# EAGLE design esp32_makey_shield (EAGLE 9.6.2)
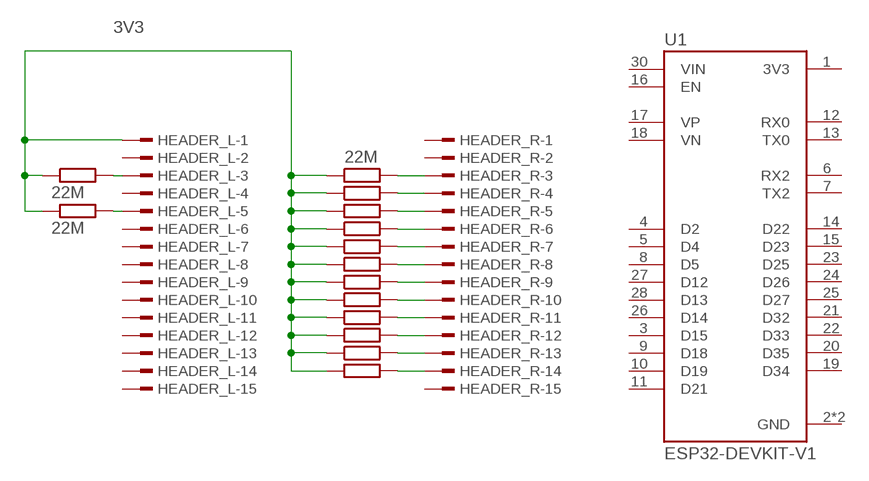
[diagram p0: schematic, sheet 1]

## Parts
HEADER_L  TSW-115-07-G-S  [TSW-115-XX-G-S]
HEADER_R  TSW-115-07-G-S  [TSW-115-XX-G-S]
R1  22M  R-EU_0204/7  [0204/7]
R2  22M  R-EU_0204/7  [0204/7]
R3  22M  R-EU_0204/7  [0204/7]
R4  22M  R-EU_0204/7  [0204/7]
R5  22M  R-EU_0204/7  [0204/7]
R6  22M  R-EU_0204/7  [0204/7]
R7  22M  R-EU_0204/7  [0204/7]
R8  22M  R-EU_0204/7  [0204/7]
R9  22M  R-EU_0204/7  [0204/7]
R10  22M  R-EU_0204/7  [0204/7]
R11  22M  R-EU_0204/7  [0204/7]
R12  22M  R-EU_0204/7  [0204/7]
R13  22M  R-EU_0204/7  [0204/7]
R14  22M  R-EU_0204/7  [0204/7]
U1  ESP32-DEVKIT-V1  [MODULE_ESP32_DEVKIT_V1]

## Nets
3V3: HEADER_L.1 R1.1 R2.1 R3.1 R4.1 R5.1 R6.1 R7.1 R8.1 R9.1 R10.1 R11.1 R12.1 R13.1 R14.1
N$1: HEADER_L.3 R13.2
N$2: HEADER_L.5 R14.2
N$3: HEADER_R.3 R1.2
N$4: HEADER_R.4 R2.2
N$5: HEADER_R.5 R3.2
N$6: HEADER_R.6 R4.2
N$7: HEADER_R.7 R5.2
N$8: HEADER_R.8 R6.2
N$9: HEADER_R.9 R7.2
N$10: HEADER_R.10 R8.2
N$11: HEADER_R.11 R9.2
N$12: HEADER_R.12 R10.2
N$13: HEADER_R.13 R11.2
N$14: HEADER_R.14 R12.2
Unconnected: HEADER_L.2 HEADER_L.4 HEADER_L.6 HEADER_L.7 HEADER_L.8 HEADER_L.9 HEADER_L.10 HEADER_L.11 HEADER_L.12 HEADER_L.13 HEADER_L.14 HEADER_L.15 HEADER_R.1 HEADER_R.2 HEADER_R.15 U1.1(3V3) U1.3(D15) U1.4(D2) U1.5(D4) U1.6(RX2) U1.7(TX2) U1.8(D5) U1.9(D18) U1.10(D19) U1.11(D21) U1.12(RX0) U1.13(TX0) U1.14(D22) U1.15(D23) U1.16(EN) U1.17(VP) U1.18(VN) U1.19(D34) U1.20(D35) U1.21(D32) U1.22(D33) U1.23(D25) U1.24(D26) U1.25(D27) U1.26(D14) U1.27(D12) U1.28(D13) U1.30(VIN)

## Power pins joined to a net without a drawn wire
GND: U1.2(GND) U1.29(GND)

## Library data of the parts
HEADER_L HEADER_R = con-samtec:TSW-115-*-G-S: THROUGH-HOLE .025" SQ POST HEADER Source: Samtec TSW.pdf; MF: Samtec Inc.; MPN: TSW-115-07-G-S
R1-R14 = rcl:R-EU_: RESISTOR, European symbol; SPICEPREFIX: R
U1 = ESP32-DEVKIT-V1:ESP32-DEVKIT-V1: Dual core, Wi-Fi: 2.4 GHz up to 150 Mbits/s,BLE (Bluetooth Low Energy) and legacy Bluetooth, 32 bits, Up to 240 MHz Check availability <https://pricing.snapeda.com/parts/ESP32-DEVKIT-V1/Do%20it/view-part?ref=eda>; AVAILABILITY: Not in stock; DESCRIPTION: Dual core, Wi-Fi: 2.4 GHz up to 150 Mbits/s,BLE (Bluetooth Low Energy) and legacy Bluetooth, 32 bits, Up to 240 MHz; MF: Do it; MP: ESP32-DEVKIT-V1; PACKAGE: None; PRICE: None

## Net classes
0 default: clearance 0.205 mm

## Board
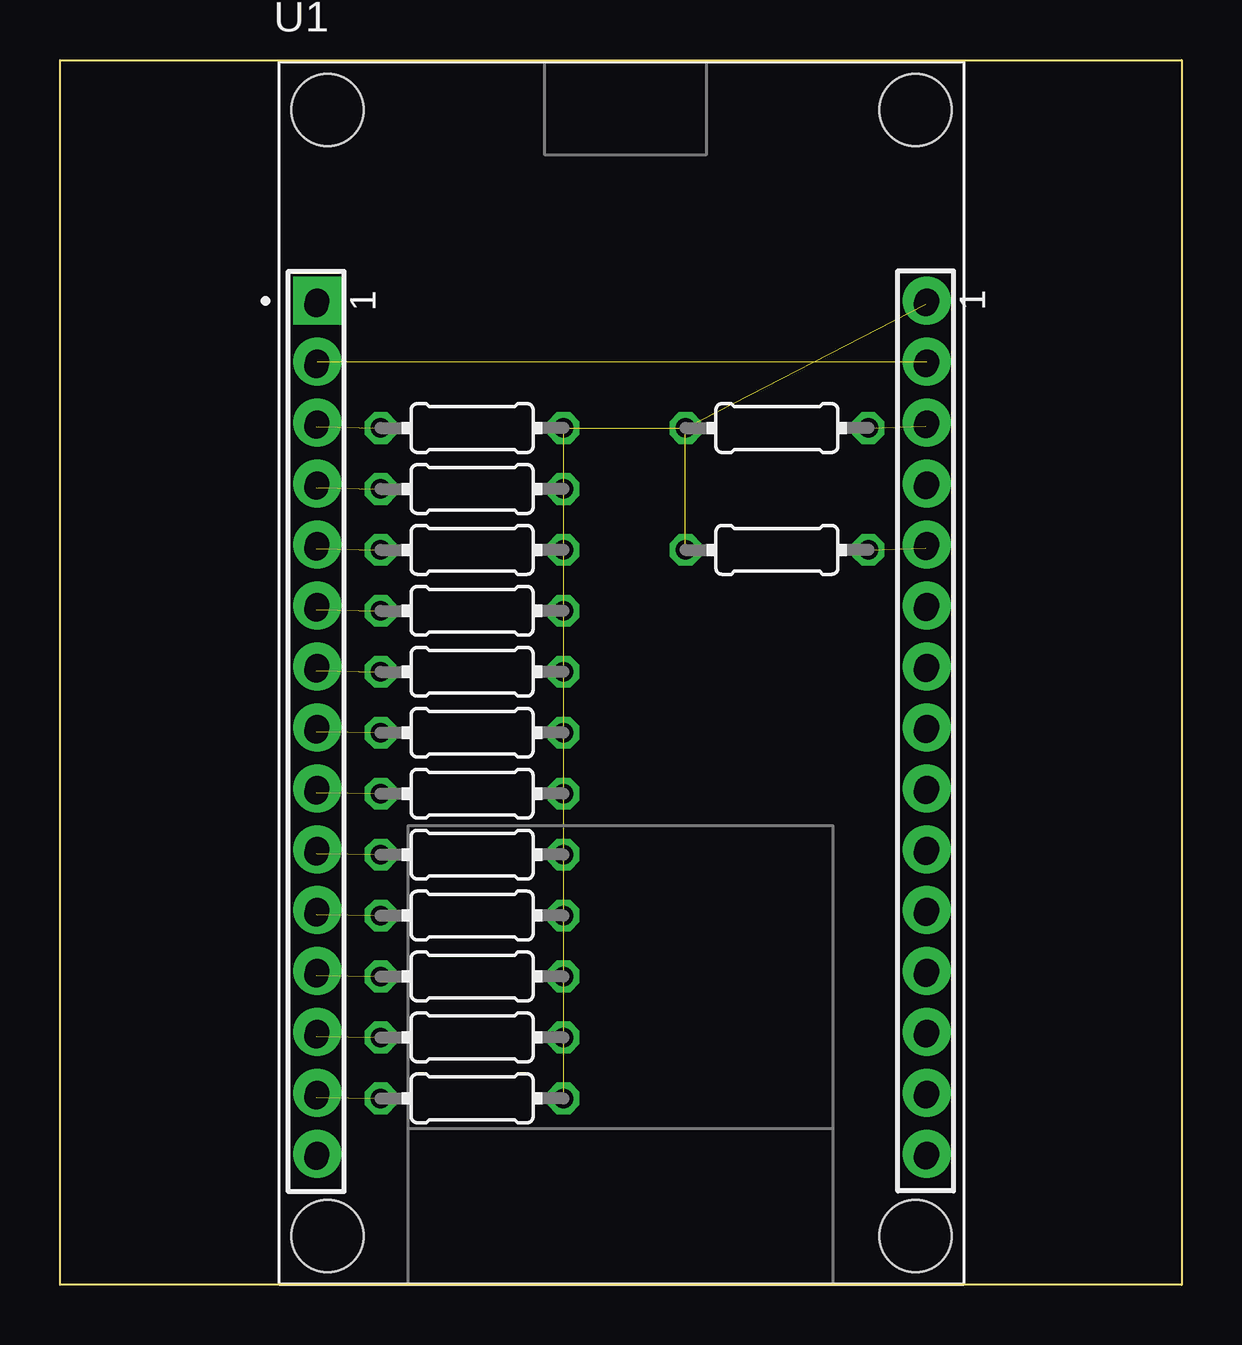
[diagram p1: board, top side]
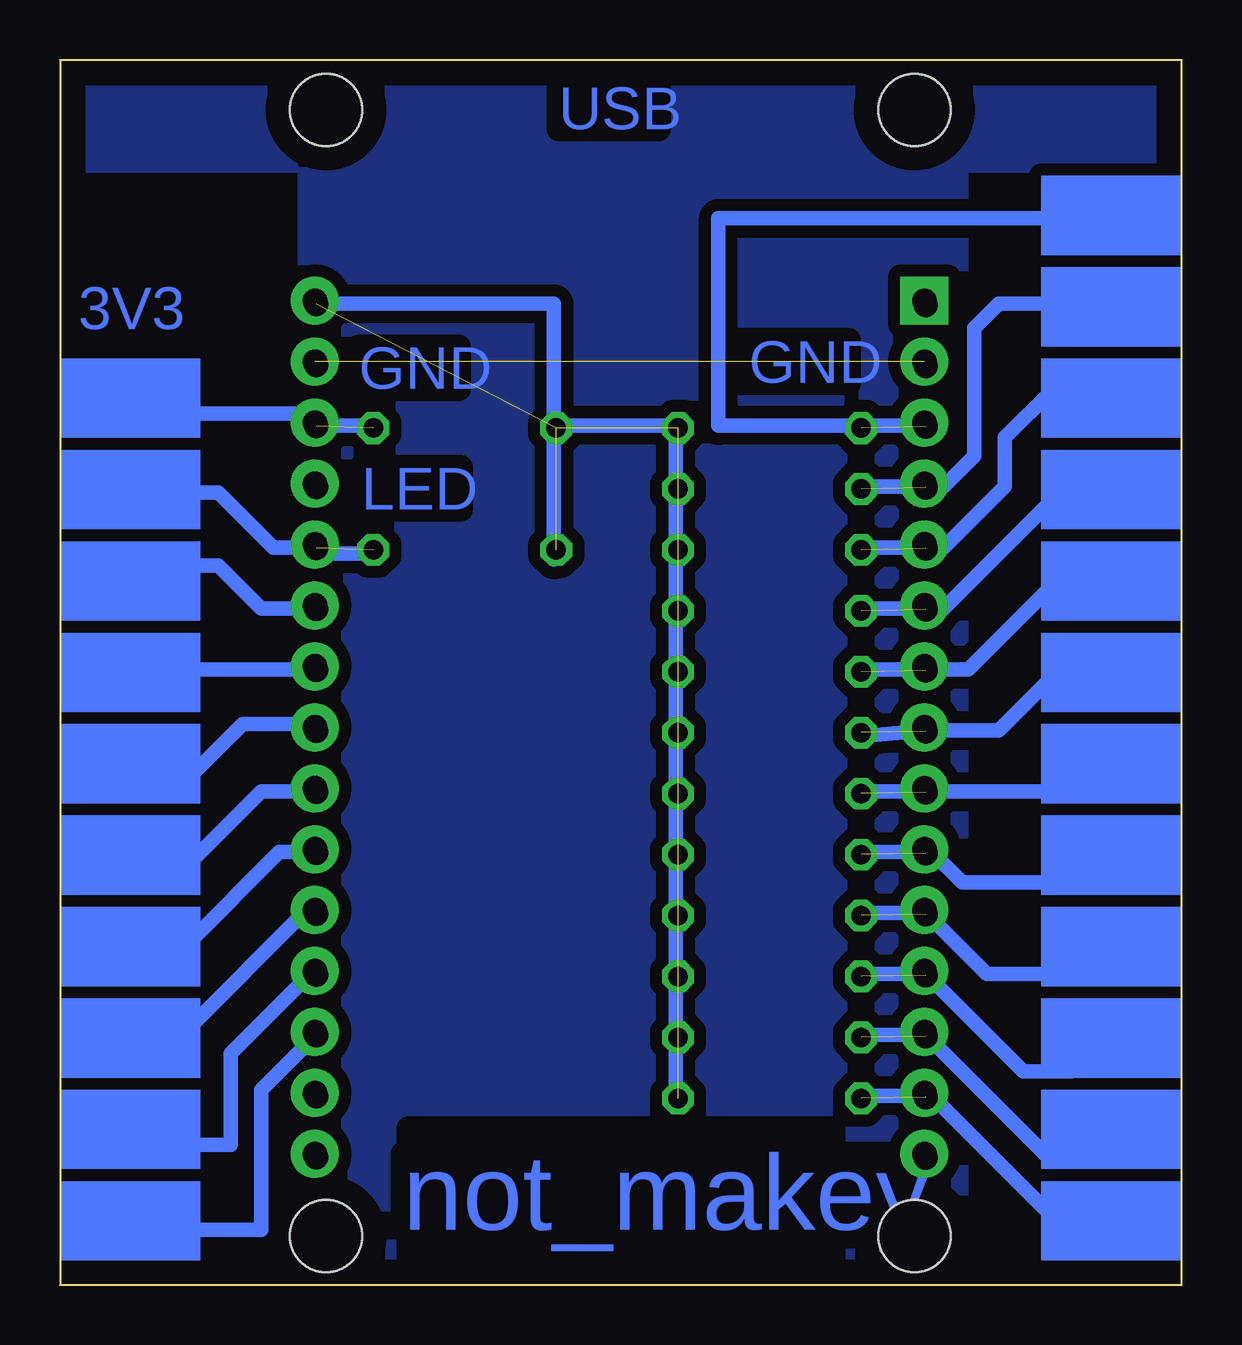
[diagram p2: board, bottom side, seen from below]

Size 46.74 x 51.05 mm. Coordinates in mm from the lower left corner, seen from the top.
Outline: 0,51.05 46.74,51.05 46.74,0 0,0 0,51.05
Copper layers (1*16): Top 0.035mm / dielectric 1.5mm / Bottom 0.035mm
Design rules "esp32_makey_shield": minimum track width 6mil, minimum drill 0.35mm, track to track 0.205mm, track to pad 0.205mm, pad to pad 0.205mm, via to via 0.205mm, smd to smd 6mil, copper to edge 40mil, drill to drill 6mil, minimum pad ring 10mil, minimum via ring 8mil, stop-mask expansion 4mil, vias tented up to drill 0mil, thermal gap 10mil
vRestrict: area -1.4,-1.1 to 47.8,51.8

### Footprints (pad centres in the part's own frame; a part is rotated, then mirrored left to right if it is on the bottom)
TSW-115-XX-G-S = drill 1 pad 1.5 octagon: 1 17.78,0; 2 15.24,0; 3 12.7,0; 4 10.16,0; 5 7.62,0; 6 5.08,0; 7 2.54,0; 8 0,0; 9 -2.54,0; 10 -5.08,0; 11 -7.62,0; 12 -10.16,0; 13 -12.7,0; 14 -15.24,0; 15 -17.78,0
0204/7 = drill 0.813 octagon: 1 -3.81,0; 2 3.81,0
MODULE_ESP32_DEVKIT_V1 = drill 1.02 pad 2 square: 1 -12.7,15.515 | drill 1.02 pad 2: 2 -12.7,12.975; 3 -12.7,10.435; 4 -12.7,7.895; 5 -12.7,5.355; 6 -12.7,2.815; 7 -12.7,0.275; 8 -12.7,-2.265; 9 -12.7,-4.805; 10 -12.7,-7.345; 11 -12.7,-9.885; 12 -12.7,-12.425; 13 -12.7,-14.965; 14 -12.7,-17.505; 15 -12.7,-20.045; 16 12.7,-20.045; 17 12.7,-17.505; 18 12.7,-14.965; 19 12.7,-12.425; 20 12.7,-9.885; 21 12.7,-7.345; 22 12.7,-4.805; 23 12.7,-2.265; 24 12.7,0.275; 25 12.7,2.815; 26 12.7,5.355; 27 12.7,7.895; 28 12.7,10.435; 29 12.7,12.975; 30 12.7,15.515 | hole 3: -12.28,-23.475; 12.23,-23.475; 12.23,23.475; -12.28,23.475

### Placement (x,y rotation side)
HEADER_L  36.07,23.09 90 top
HEADER_R  10.67,23.06 90 top
R1  17.17,35.71 180 top
R2  17.17,33.17 180 top
R3  17.17,30.63 180 top
R4  17.17,28.09 180 top
R5  17.17,25.55 180 top
R6  17.17,23.01 180 top
R7  17.17,20.47 180 top
R8  17.17,17.93 180 top
R9  17.17,15.39 180 top
R10  17.17,12.85 180 top
R11  17.17,10.31 180 top
R12  17.17,7.77 180 top
R13  29.87,35.71 0 top
R14  29.87,30.63 0 top
U1  23.42,25.5 0 top

### Tracks (layer width: path | path; a pad name or v marks a point on that pad's centre or on a via)
3V3  (14 unrouted)
GND  (1 unrouted)
N$1  (1 unrouted)
N$2  (1 unrouted)
N$3  (1 unrouted)
N$4  (1 unrouted)
N$5  (1 unrouted)
N$6  (1 unrouted)
N$7  (1 unrouted)
N$8  (1 unrouted)
N$9  (1 unrouted)
N$10  (1 unrouted)
N$11  (1 unrouted)
N$12  (1 unrouted)
N$13  (1 unrouted)
N$14  (1 unrouted)
N$15
  Bottom 0.61: 10.41,35.81 19.3,35.81 19.3,44.45 3.56,44.45
N$16  (via drill 0.02 pad 0.79)
  other vias: 33.68,35.71
N$17
  Bottom 0.61: 13.46,33.27 9.91,33.27 8.64,34.54 8.64,39.88 7.62,40.89 2.79,40.89
N$18
  Bottom 0.61: 13.46,30.73 9.91,30.73 7.37,33.27 7.37,35.31 5.33,37.34
N$19
  Bottom 0.61: 13.46,28.19 10.92,28.19 10.67,28.19 9.91,28.19 4.83,33.27
N$20
  Bottom 0.61: 13.46,25.65 8.89,25.65 4.83,29.72
N$21
  Bottom 0.61: 13.46,22.86 10.67,23.11 7.62,23.11 5.33,25.4
N$22
  Bottom 0.61: 13.46,20.57 5.08,20.57
N$23
  Bottom 0.61: 10.41,18.03 13.46,18.03
N$24
  Bottom 0.61: 13.46,15.49 10.67,15.49 8.13,12.95 5.08,12.95
N$25
  Bottom 0.61: 13.46,12.95 10.67,12.95 6.6,8.89 4.57,8.89
N$26
  Bottom 0.61: 13.46,10.41 10.67,10.41 5.59,5.33 5.33,5.33
N$27
  Bottom 0.61: 13.46,7.87 10.41,7.87 5.08,2.54
N$28
  Bottom 0.61: 21.08,7.87 21.08,35.81 26.16,35.81 | 26.16,35.81 26.16,30.23 | 36.07,40.89 26.16,40.89 26.16,35.81
N$29
  Bottom 0.61: 33.53,35.81 36.07,35.81 | 36.07,35.81 36.32,35.81 | 36.07,35.81 36.58,36.32 43.18,36.32
N$30
  Bottom 0.61: 36.07,30.73 36.07,30.48 33.78,30.48
N$31
  Bottom 0.61: 10.67,18.29 9.14,16.76 4.83,16.76
N$32
  Bottom 0.61: 36.32,30.73 37.85,30.73 40.13,33.02 43.94,33.02
N$33
  Bottom 0.61: 36.32,28.19 38.35,28.19 40.13,29.97 42.42,29.97
N$34
  Bottom 0.61: 36.32,25.65 42.93,25.65 43.18,25.91
N$35
  Bottom 0.61: 35.81,23.37 39.12,23.37 41.66,20.83
N$36
  Bottom 0.61: 36.07,20.57 38.35,20.57 41.4,17.53
N$37
  Bottom 0.61: 36.32,18.03 37.59,18.03 41.4,14.22
N$38
  Bottom 0.61: 36.07,15.49 36.58,15.49 41.4,10.67
N$39
  Bottom 0.61: 36.07,13.21 39.62,9.65 39.62,5.84 42.67,5.84 42.93,6.1
N$40
  Bottom 0.61: 35.81,10.67 38.35,8.13 38.35,2.29 43.18,2.29
N$41  (via drill 0.02 pad 0.79)
  other vias: 33.68,30.64
N$42  (via drill 0.02 pad 0.79)
  other vias: 26.06,35.71
N$43  (via drill 0.02 pad 0.79)
  other vias: 26.06,30.63
N$44  (via drill 0.02 pad 0.79)
  other vias: 20.98,35.71
N$45  (via drill 0.02 pad 0.79)
  other vias: 20.98,33.17
N$46  (via drill 0.02 pad 0.79)
  other vias: 20.98,30.63
N$47  (via drill 0.02 pad 0.79)
  other vias: 20.98,28.09
N$48  (via drill 0.02 pad 0.79)
  other vias: 20.98,25.55
N$49  (via drill 0.02 pad 0.79)
  other vias: 20.98,23.01
N$50  (via drill 0.02 pad 0.79)
  other vias: 20.98,20.47
N$51  (via drill 0.02 pad 0.79)
  other vias: 20.98,17.93
N$52  (via drill 0.02 pad 0.79)
  other vias: 20.98,15.39
N$53  (via drill 0.02 pad 0.79)
  other vias: 20.98,12.85
N$54  (via drill 0.02 pad 0.79)
  other vias: 20.98,10.31
N$55  (via drill 0.02 pad 0.79)
  other vias: 20.98,7.77
N$56  (via drill 0.02 pad 0.81)
  other vias: 13.36,35.71
N$57  (via drill 0.02 pad 0.81)
  other vias: 13.36,33.17
N$58  (via drill 0.02 pad 0.81)
  other vias: 13.36,30.64
N$59  (via drill 0.02 pad 0.81)
  other vias: 13.37,28.09
N$60  (via drill 0.02 pad 0.81)
  other vias: 13.36,25.56
N$61  (via drill 0.02 pad 0.81)
  other vias: 13.36,23.01
N$62  (via drill 0.02 pad 0.81)
  other vias: 13.36,20.47
N$63  (via drill 0.02 pad 0.81)
  other vias: 13.36,17.94
N$64  (via drill 0.02 pad 0.81)
  other vias: 13.36,15.39
N$65  (via drill 0.02 pad 0.81)
  other vias: 13.36,12.85
N$66  (via drill 0.02 pad 0.81)
  other vias: 13.36,10.32
N$67  (via drill 0.02 pad 0.81)
  other vias: 13.36,7.77
N$68  (via drill 0.02 pad 1.02)
  other vias: 36.12,41.02
N$69  (via drill 0.02 pad 1.02)
  other vias: 36.07,38.34
N$70  (via drill 0.02 pad 1.02)
  other vias: 36.12,35.94
N$71  (via drill 0.02 pad 1.02)
  other vias: 36.12,33.4
N$72  (via drill 0.02 pad 1.02)
  other vias: 36.12,30.86
N$73  (via drill 0.02 pad 1.02)
  other vias: 36.12,28.31
N$74  (via drill 0.02 pad 1.02)
  other vias: 36.12,25.78
N$75  (via drill 0.02 pad 1.02)
  other vias: 36.12,23.24
N$76  (via drill 0.02 pad 1.02)
  other vias: 36.12,20.7
N$77  (via drill 0.02 pad 1.02)
  other vias: 36.12,18.15
N$78  (via drill 0.02 pad 1.02)
  other vias: 36.12,15.62
N$79  (via drill 0.02 pad 1.02)
  other vias: 36.12,13.08
N$80  (via drill 0.02 pad 1.02)
  other vias: 36.12,10.54
N$81  (via drill 0.02 pad 1.02)
  other vias: 36.12,7.99
N$82  (via drill 0.02 pad 1.02)
  other vias: 36.12,5.46
N$83  (via drill 0.02 pad 1.02)
  other vias: 10.72,41.02
N$84  (via drill 0.02 pad 1.02)
  other vias: 10.67,38.3
N$85  (via drill 0.02 pad 1.02)
  other vias: 10.72,35.94
N$86  (via drill 0.02 pad 1.02)
  other vias: 10.72,33.4
N$87  (via drill 0.02 pad 1.02)
  other vias: 10.72,30.86
N$88  (via drill 0.02 pad 1.02)
  other vias: 10.72,28.32
N$89  (via drill 0.02 pad 1.02)
  other vias: 10.72,25.78
N$90  (via drill 0.02 pad 1.02)
  other vias: 10.72,23.24
N$91  (via drill 0.02 pad 1.02)
  other vias: 10.72,20.7
N$92  (via drill 0.02 pad 1.02)
  other vias: 10.72,18.16
N$93  (via drill 0.02 pad 1.02)
  other vias: 10.72,15.62
N$94  (via drill 0.02 pad 1.02)
  other vias: 10.72,13.08
N$95  (via drill 0.02 pad 1.02)
  other vias: 10.72,10.54
N$96  (via drill 0.02 pad 1.02)
  other vias: 10.72,8
N$97  (via drill 0.02 pad 1.02)
  other vias: 10.72,5.46
PLANE
  pour Bottom (isolate 0.508, no thermals): 9.14,51 9.14,-0.05 36.58,-0.05 36.58,51
  pour Bottom (isolate 0.508, no thermals): -0.36,51.1 -0.36,46.58 46.43,46.58 46.43,51.1
(copper drawn outside any net)
  shapes: Bottom area x25

### Text on the board
Bottom: USB | 3V3 | GND | GND | LED | not_makey | [ ]